# Altium schematic sheet Transmitter Schematic.SchDoc
size A; SheetNumber: 1; SheetTotal: 1
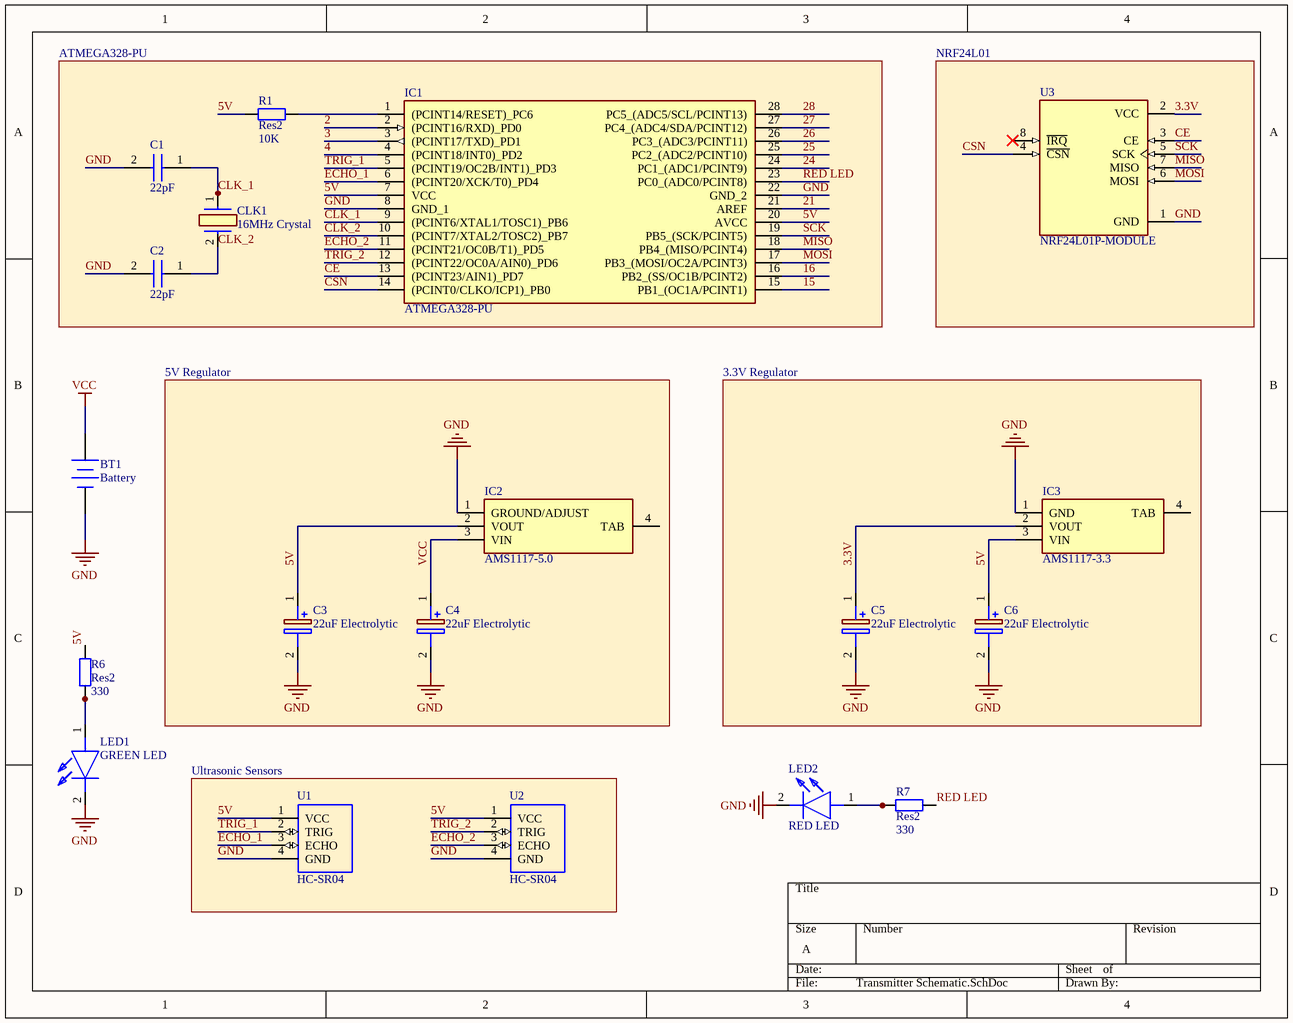
[diagram p0: Transmitter Schematic.SchDoc]

## Parts
BT1  Battery  [BAT-2]
C1  22pF  [S220K25SL0N63L6R]
C2  22pF  [S220K25SL0N63L6R]
C3  22uF Electrolytic  [CAPPRD250W55D630H1220]
C4  22uF Electrolytic  [CAPPRD250W55D630H1220]
C5  22uF Electrolytic  [CAPPRD250W55D630H1220]
C6  22uF Electrolytic  [CAPPRD250W55D630H1220]
CLK1  16MHz Crystal  [LFXTAL036391Bulk]
IC1  ATMEGA328-PU  [DIP1016W53P254L3468H457Q28N]
IC2  AMS1117-5.0  [SOT229P700X180-4N]
IC3  AMS1117-3.3  [SOT229P700X180-4N]
LED1  GREEN LED  [125410SURTS530A3]
LED2  RED LED  [125410SURTS530A3]
R1  Res2  value 10K  [AXIAL-0.4]
R6  Res2  value 330  [AXIAL-0.4]
R7  Res2  value 330  [AXIAL-0.4]
U1  HC-SR04  [XCVR_HC-SR04]
U2  HC-SR04  [XCVR_HC-SR04]
U3  NRF24L01P-MODULE  [XCVR_NRF24L01P-MODULE-PCB]

## Blocks framed on the sheet
ATMEGA328-PU: C1 C2 CLK1 IC1 R1
NRF24L01: U3
5V Regulator: C3 C4 IC2
3.3V Regulator: C5 C6 IC3
Ultrasonic Sensors: U1 U2

## Nets
GND: BT1.2(-) C1.2 C2.2 C3.2(-) C4.2(-) C5.2(-) C6.2(-) IC1.8(GND_1) IC1.22(GND_2) IC2.1(GROUND/ADJUST) IC3.1(GND) LED1.2(K) LED2.2(K) U1.4(GND) U2.4(GND) U3.1(GND)
VCC: BT1.1(+) C4.1(+) IC2.3(VIN)
2: IC1.2((PCINT16/RXD)_PD0)
3: IC1.3((PCINT17/TXD)_PD1)
3.3V: C5.1(+) IC3.2(VOUT) U3.2(VCC)
4: IC1.4((PCINT18/INT0)_PD2)
5V: C3.1(+) C6.1(+) IC1.7(VCC) IC1.20(AVCC) IC2.2(VOUT) IC3.3(VIN) R1.1 R6.2 U1.1(VCC) U2.1(VCC)
15: IC1.15(PB1_(OC1A/PCINT1))
16: IC1.16(PB2_(SS/OC1B/PCINT2))
21: IC1.21(AREF)
24: IC1.24(PC1_(ADC1/PCINT9))
25: IC1.25(PC2_(ADC2/PCINT10))
26: IC1.26(PC3_(ADC3/PCINT11))
27: IC1.27(PC4_(ADC4/SDA/PCINT12))
28: IC1.28(PC5_(ADC5/SCL/PCINT13))
CE: IC1.13((PCINT23/AIN1)_PD7) U3.3(CE)
CLK_1: C1.1 CLK1.1(CRYSTAL_1) IC1.9((PCINT6/XTAL1/TOSC1)_PB6)
CLK_2: C2.1 CLK1.2(CRYSTAL_2) IC1.10((PCINT7/XTAL2/TOSC2)_PB7)
CSN: IC1.14((PCINT0/CLKO/ICP1)_PB0) U3.4(~{CSN})
ECHO_1: IC1.6((PCINT20/XCK/T0)_PD4) U1.3(ECHO)
ECHO_2: IC1.11((PCINT21/OC0B/T1)_PD5) U2.3(ECHO)
MISO: IC1.18(PB4_(MISO/PCINT4)) U3.7(MISO)
MOSI: IC1.17(PB3_(MOSI/OC2A/PCINT3)) U3.6(MOSI)
RED LED: IC1.23(PC0_(ADC0/PCINT8)) R7.2
SCK: IC1.19(PB5_(SCK/PCINT5)) U3.5(SCK)
TRIG_1: IC1.5((PCINT19/OC2B/INT1)_PD3) U1.2(TRIG)
TRIG_2: IC1.12((PCINT22/OC0A/AIN0)_PD6) U2.2(TRIG)
NetIC1_1: IC1.1((PCINT14/RESET)_PC6) R1.2
NetLED1_1: LED1.1(A) R6.1
NetLED2_1: LED2.1(A) R7.1

Not connected (* = marked no-connect by the designer): IC2 4(TAB); IC3 4(TAB); U3 8(~{IRQ})*

## Library data of the parts
BT1 = Battery: Multicell Battery; Published: 24-Mar-1999; LatestRevisionDate: 17-Jul-2002; LatestRevisionNote: Re-released for DXP Platform.; PackageReference: BAT-2; Publisher: Altium Limited; PackageDescription: Battery; 2 Leads
C1 C2 = S220K25SL0N63L6R: Capacitor Ceramic THT; Manufacturer_Name: Vishay; Datasheet Link: http://www.vishay.com/docs/28515/sseries.pdf; Height: 6.5mm; Manufacturer_Part_Number: S220K25SL0N63L6R; Mouser Part Number: 594-S220K25SL0N63L6R; Mouser Price/Stock: https://www.mouser.co.uk/ProductDetail/Vishay-BC-Components/S220K25SL0N63L6R?qs=a%252BZougrH3ehuV7s4gtTaOA%3D%3D; Arrow Part Number: S220K25SL0N63L6R; Arrow Price/Stock: https://www.arrow.com/en/products/s220k25sl0n63l6r/vishay?region=nac
C3-C6 = ECA1EEN220: Capacitor Polarised; Manufacturer_Name: Panasonic; Datasheet Link: http://industrial.panasonic.com/cdbs/www-data/pdf/RDF0000/ABA0000C1044.pdf; Height: 12.2mm; Manufacturer_Part_Number: ECA1EEN220
CLK1 = LFXTAL036391Bulk: Crystal or Oscillator; Manufacturer_Name: IQD; Datasheet Link: https://componentsearchengine.com/Datasheets/1/LFXTAL036391Bulk.pdf; Height: 4.1mm; Manufacturer_Part_Number: LFXTAL036391Bulk; Mouser Part Number: 449-LFXTAL036391BULK; Mouser Price/Stock: https://www.mouser.co.uk/ProductDetail/IQD/LFXTAL036391Bulk?qs=e4%2FAndAAwgLVSm%2FKWOsYLg%3D%3D
IC1 = ATMEGA328-PU: Integrated Circuit; Manufacturer_Name: Microchip; Datasheet Link: https://componentsearchengine.com/Datasheets/1/ATMEGA328-PU.pdf; Height: 4.572mm; Manufacturer_Part_Number: ATMEGA328-PU; Mouser Part Number: 556-ATMEGA328-PU; Mouser Price/Stock: https://www.mouser.co.uk/ProductDetail/Microchip-Technology/ATMEGA328-PU?qs=lwdSMh1%2FoYJT8tfItQpQtA%3D%3D; Arrow Part Number: ATMEGA328-PU; Arrow Price/Stock: https://www.arrow.com/en/products/atmega328-pu/microchip-technology?region=nac
IC2 = AMS1117-5.0: Integrated Circuit; Manufacturer_Name: Advanced Monolithic Systems; Datasheet Link: http://www.advanced-monolithic.com/pdf/ds1117.pdf; Height: 1.8mm; Manufacturer_Part_Number: AMS1117-5.0
IC3 = AMS1117-3.3: Integrated Circuit; Manufacturer_Name: Advanced Monolithic Systems; Datasheet Link: http://www.advanced-monolithic.com/pdf/ds1117.pdf; Height: 1.8mm; Manufacturer_Part_Number: AMS1117-3.3
LED1 LED2 = 1254-10SURT_S530-A3: LED; Manufacturer_Name: Everlight; Manufacturer_Part_Number: 1254-10SURT/S530-A3; Datasheet Link: https://datasheet.datasheetarchive.com/originals/distributors/Datasheets-3/DSA-55877.pdf; Height: 5.2mm; Arrow Part Number: 1254-10SURT/S530-A3; Arrow Price/Stock: https://www.arrow.com/en/products/1254-10surts530-a3/everlight-electronics?region=nac
R1 R6 R7 = Res2: Resistor; Published: 8-Jun-2000; LatestRevisionDate: 17-Jul-2002; LatestRevisionNote: Re-released for DXP Platform.; PackageReference: AXIAL-0.4; Publisher: Altium Limited; PackageDescription: Axial Device, Thru-Hole; 2 Leads; 0.4 in Pin Spacing
U1 U2 = HC-SR04: Ultrasonic Sensor Module; Availability: Unavailable; MP: HC-SR04; Value: *; Price: None; Package: None
U3 = NRF24L01P-MODULE-PCB: - Transceiver For Use With nRF24L01+; MF: Nordic Semiconductor; Package: None; MP: NRF24L01P-MODULE-PCB; Value: *; Availability: Bad; Price: None; SnapEDA_Link: https://www.snapeda.com/parts/NRF24L01P-MODULE-PCB/Nordic%20Semiconductor%20ASA/view-part/230534/?ref=snap; Mouser-Purchase-URL: https://snapeda.com/shop?store=Mouser&id=230534